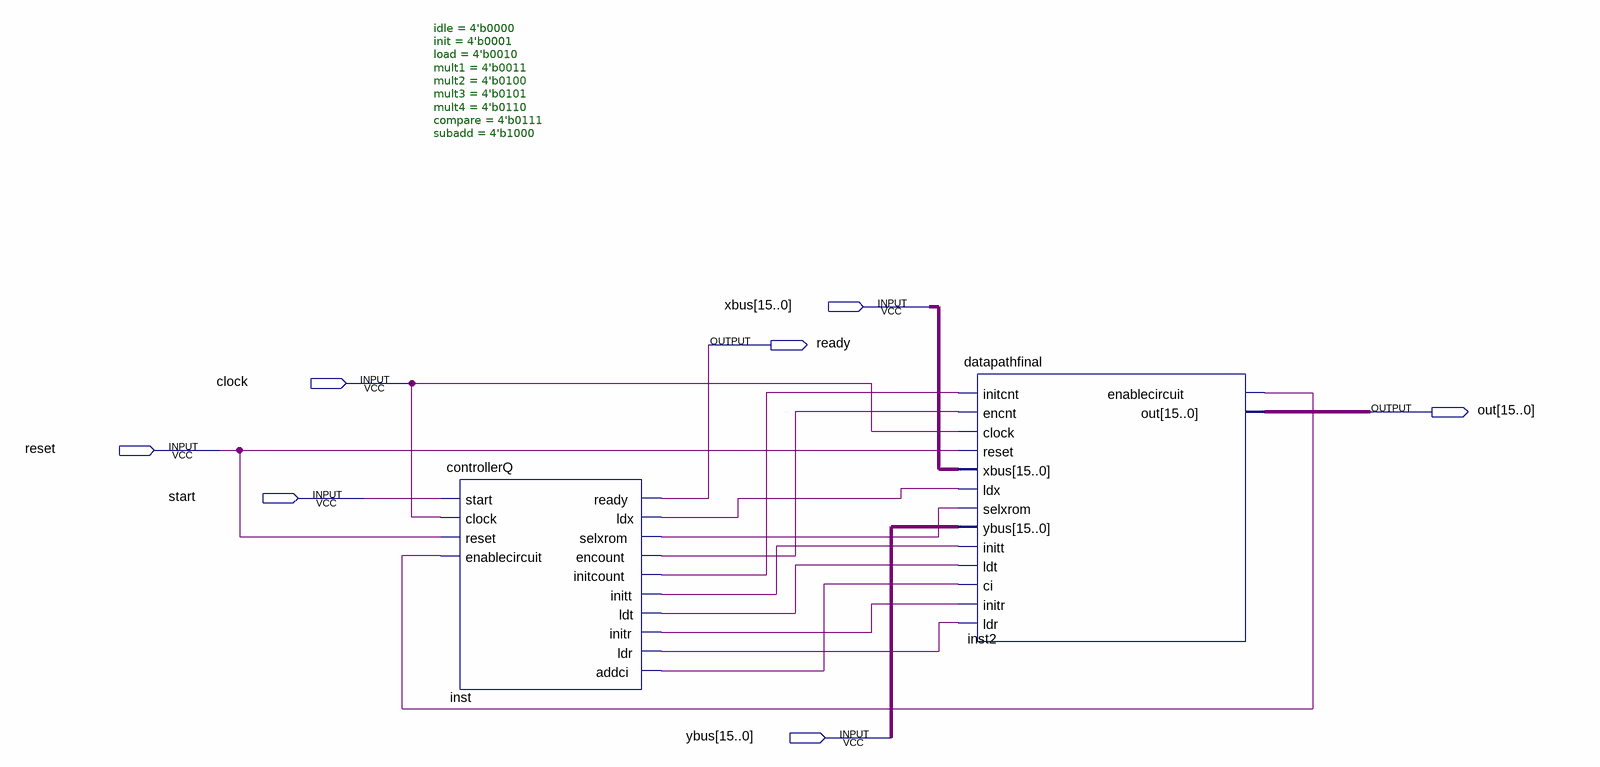
[diagram p0: schematic sheet]
// Quartus schematic circuit.bdf as structural Verilog: 2 symbols, 7 pins
module circuit (
  input  [15:0] xbus,
  input  clock,
  input  reset,
  input  start,
  input  [15:0] ybus,
  output ready,
  output [15:0] out
);

  wire inst2_enablecircuit, inst_addci, inst_encount, inst_initcount, inst_initr, inst_initt, inst_ldr,
       inst_ldt, inst_ldx, inst_selxrom;

  controllerQ #(.idle(4'b0000), .init(4'b0001), .load(4'b0010), .mult1(4'b0011), .mult2(4'b0100), .mult3(4'b0101), .mult4(4'b0110), .compare(4'b0111), .subadd(4'b1000)) inst (
    .start(start), .clock(clock), .reset(reset), .enablecircuit(inst2_enablecircuit), .ready(ready),
    .ldx(inst_ldx), .selxrom(inst_selxrom), .encount(inst_encount), .initcount(inst_initcount),
    .initt(inst_initt), .ldt(inst_ldt), .initr(inst_initr), .ldr(inst_ldr), .addci(inst_addci));
  datapathfinal inst2 (
    .initcnt(inst_initcount), .encnt(inst_encount), .clock(clock), .reset(reset), .xbus(xbus),
    .ldx(inst_ldx), .selxrom(inst_selxrom), .ybus(ybus), .initt(inst_initt), .ldt(inst_ldt), .ci(inst_addci),
    .initr(inst_initr), .ldr(inst_ldr), .enablecircuit(inst2_enablecircuit), .out(out));
endmodule
